# EAGLE design 20190105_ORIGAMI_V1-H-08slot-fixed (EAGLE 9.2.2)
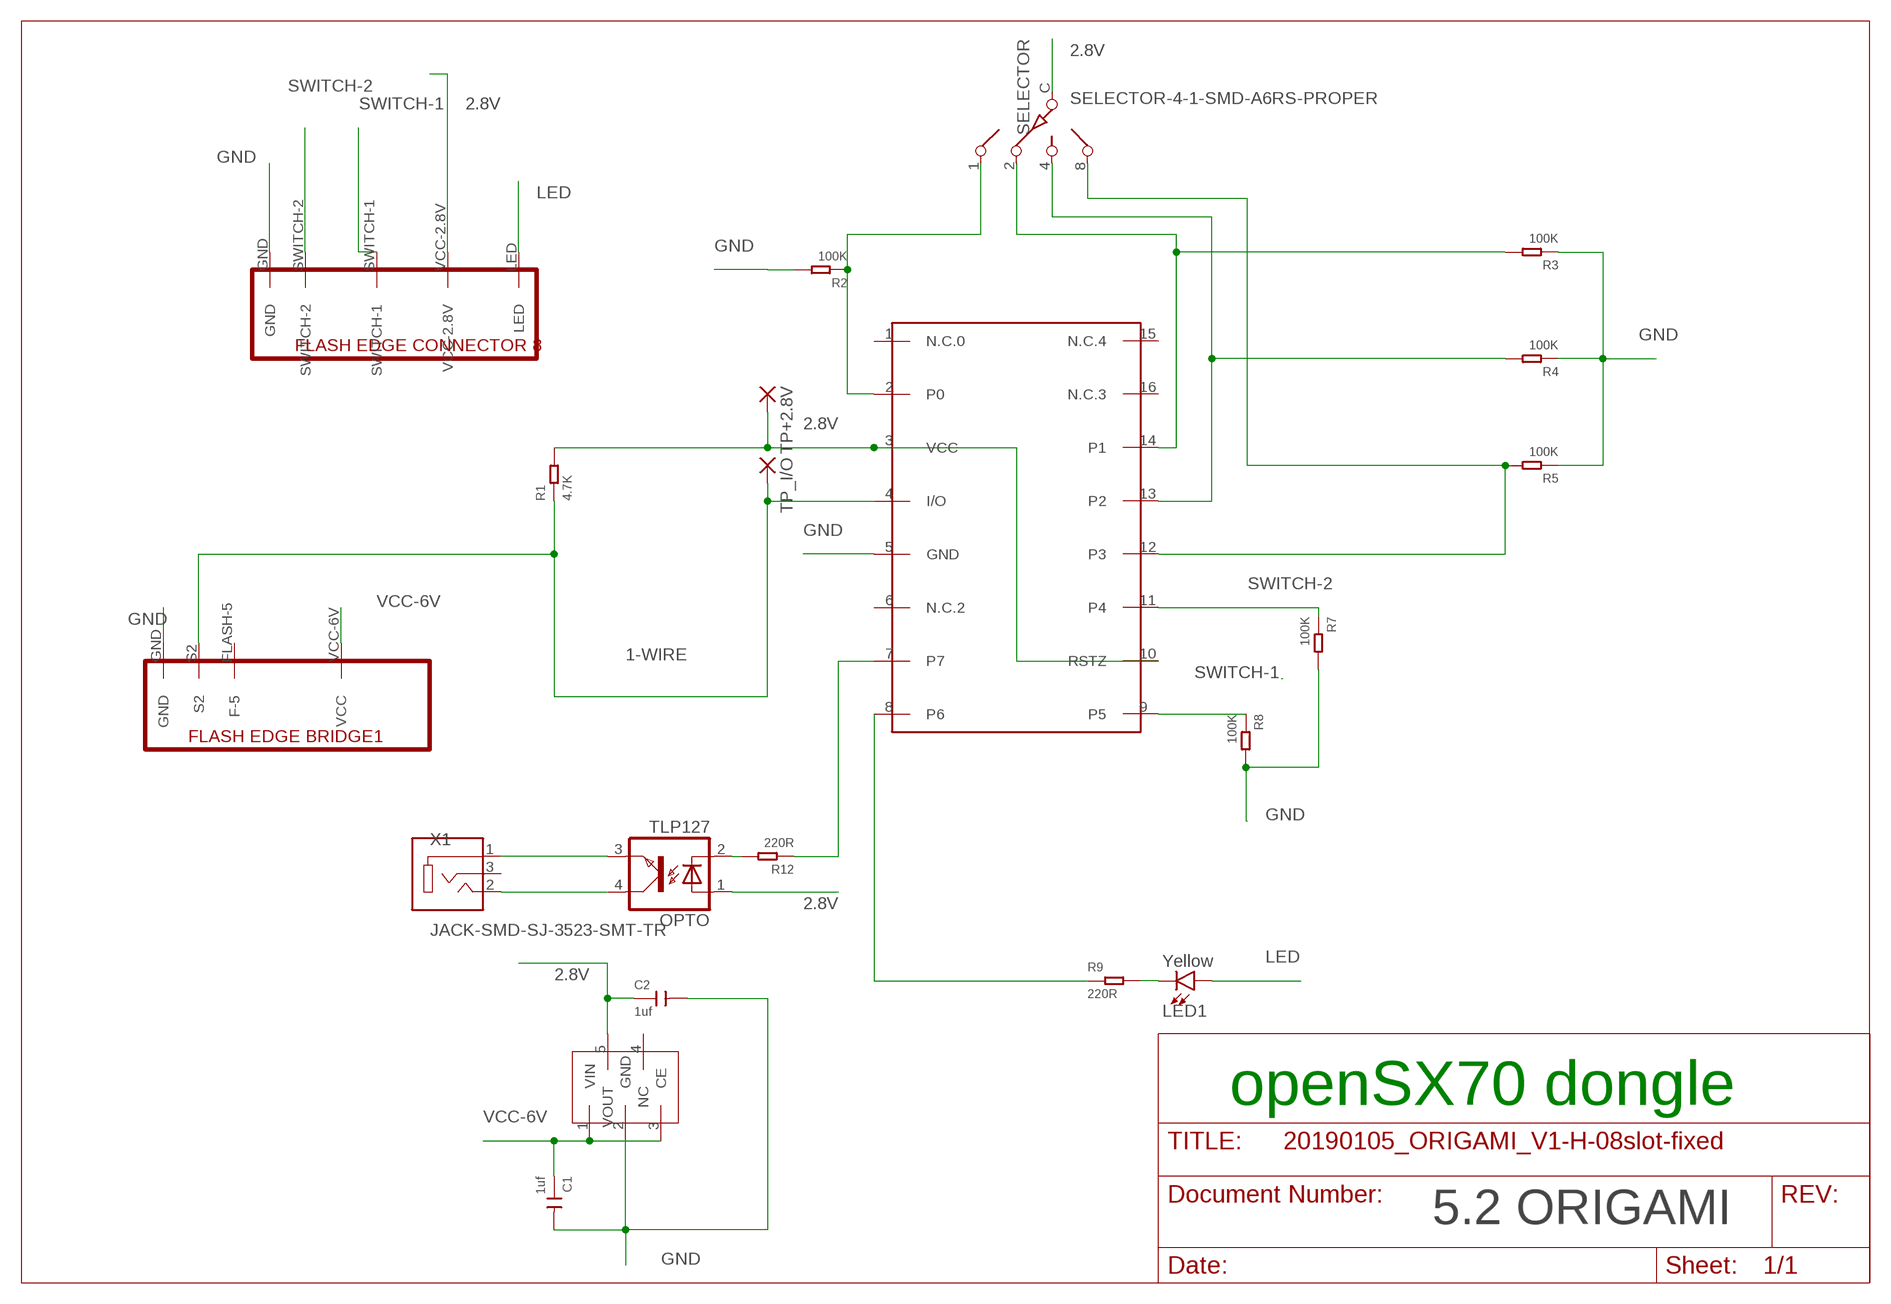
[diagram p0: schematic, sheet 1]

## Parts
C1  1uf  CERAMIC-1UF-25V-10%-X7R(0603)  [C0603]
C2  1uf  CERAMIC-1UF-25V-10%-X7R(0603)  [C0603]
DS2408  DS2408  [SO16]
LED1  Yellow  LED-YELLOWLILYPAD  [LED-1206]
OPTO  TLP127  [SO-4]
R1  4.7K  SMD-RES-4.7K-5%-1/10W(0603)  [R0603]
R2  100K  SMD-RES-100K-1%-1/10W(0603)  [R0603]
R3  100K  SMD-RES-100K-1%-1/10W(0603)  [R0603]
R4  100K  SMD-RES-100K-1%-1/10W(0603)  [R0603]
R5  100K  SMD-RES-100K-1%-1/10W(0603)  [R0603]
R7  100K  SMD-RES-100K-1%-1/10W(0603)  [R0603]
R8  100K  SMD-RES-100K-1%-1/10W(0603)  [R0603]
R9  220R  SMD-RES-220R-5%-1/10W(0603)  [R0603]
R12  220R  SMD-RES-220R-5%-1/10W(0603)  [R0603]
REG  NCP4688  [SOT-23-5]
SELECTOR  SELECTOR-4-1-SMD-A6RS-PROPER  [A6RS-161RS]
TP+2.8V  SMD2  [SMD1,27-2,54]
TP_I/O  SMD2  [SMD1,27-2,54]
U$1  FLASH-BRIDGE-SW1-SW2-LED  [FLASH-8-BRIDGE-SW1-SW2-LED]
U$2  FLASH-BRIDGE1  [FLASH-8-BRIDGE1]
X1  JACK-SMD-SJ-3523-SMT-TR  [CUI_SJ-3523-SMT-TR]

## Nets
1-WIRE: DS2408.4(I/O) R1.1 TP_I/O.1(P) U$2.S2
2.8V: C2.1 DS2408.3(VCC) DS2408.10(RSTZ) OPTO.1(A) R1.2 REG.5(VOUT) SELECTOR.C TP+2.8V.1(P) U$1.VCC-2.8V
GND: C1.2 C2.2 DS2408.5(GND) R2.2 R3.1 R4.1 R5.1 R7.2 R8.2 REG.2(GND) U$1.GND U$2.GND
LED: LED1.A U$1.LED
N$1: OPTO.3(EMIT) X1.1
N$2: LED1.C R9.2
N$3: DS2408.2(P0) R2.1 SELECTOR.1
N$4: DS2408.14(P1) R3.2 SELECTOR.2
N$5: DS2408.13(P2) R4.2 SELECTOR.4
N$6: OPTO.4(COL) X1.2
N$7: DS2408.8(P6) R9.1
N$10: OPTO.2(C) R12.2
N$11: DS2408.7 R12.1
N$13: DS2408.12(P3) R5.2 SELECTOR.8
SWITCH-1: DS2408.9(P5) R8.1 U$1.SWITCH-1
SWITCH-2: DS2408.11(P4) R7.1 U$1.SWITCH-2
VCC-6V: C1.1 REG.1(VIN) REG.3(CE) U$2.VCC-6V(VCC)
Unconnected: DS2408.1(N.C.0) DS2408.6(N.C.2) DS2408.15(N.C.4) DS2408.16(N.C.3) REG.4(NC) U$2.FLASH-5(F-5) X1.3

## Notes on the sheet
- openSX70 dongle
- 5.2 ORIGAMI

## Library data of the parts
C1 C2 = Seeed-Capacitor:CERAMIC-1UF-25V-10%-X7R(0603): 302010139; MPN: CC0603KRX7R8BB105
DS2408 = _openSX70:DS2408
LED1 = SparkFun-LED:LED-YELLOW: Yellow SMD LED Used in manufacturing several products at SparkFun. Packages: 0603 - SMD 0603 package[Product Link] <http://www.kingbrightusa.com/product.asp?catalog_name=LED&product_id=APT1608SYCK> 0603 -SMART - SMART SMD 0603 package (more efficient/more expensive) [Product Link] <http://www.osram-os.com/osram_os/en/products/product-catalog/led-light-emitting-diodes/smartled-0603/ly-l29k/index.jsp> LilyPad - SMD1206 package[Product Datasheet] <https://www.sparkfun.com/datasheets/DevTools/LilyPad/Q150YUS4.pdf> SparkFun Products: Blynk Board <https://www.sparkfun.com/products/13794> IOIO-OTG <https://www.sparkfun.com/products/13613> XBee Explorer Serial <https://www.sparkfun.com/products/13225>; PROD_ID: DIO-09909
OPTO = _openSX70:TLP127
R1 = Seeed-Resistor:SMD-RES-4.7K-5%-1/10W(0603): 301010290; MPN: RC0603JR-074K7L
R2-R5 R7 R8 = Seeed-Resistor:SMD-RES-100K-1%-1/10W(0603): 301010196; MPN: RC0603FR-07100KL
R9 R12 = Seeed-Resistor:SMD-RES-220R-5%-1/10W(0603): 301010163; MPN: RC0603JR-07220RL
REG = openSX70:NCP4688
SELECTOR = _openSX70:SELECTOR-4-1-SMD-A6RS-PROPER
TP+2.8V TP_I/O = wirepad:SMD2: SMD PAD
U$1 = _openSX70:FLASH-BRIDGE-SW1-SW2-LED
U$2 = _openSX70:FLASH-BRIDGE1
X1 = _openSX70:JACK-SMD-SJ-3523-SMT-TR: Audio Jack Connector 3.5 mm Low Profile Surface Mount Stereo Jack, 3 Pin Right-Angle; AVAILABILITY: Unavailable; CUI_PURCHASE_URL: https://www.cui.com/product/interconnect/audio-connectors/3.5-mm-jacks/sj-352x-smt-series?utm_source=snapeda.com&utm_medium=referral&utm_campaign=snapedaBOM; DESCRIPTION: SJ Series 3.5 mm 12 V SMT Right Angle Stereo Audio Jack; MF: CUI Inc.; MP: SJ-3523-SMT-TR; PACKAGE: LGA-10 STMicroelectronics; PRICE: None

## Net classes
0 GND: width 0.305 mm
1 VCC: width 0.254 mm
2 2.8V: width 0.254 mm

## Board
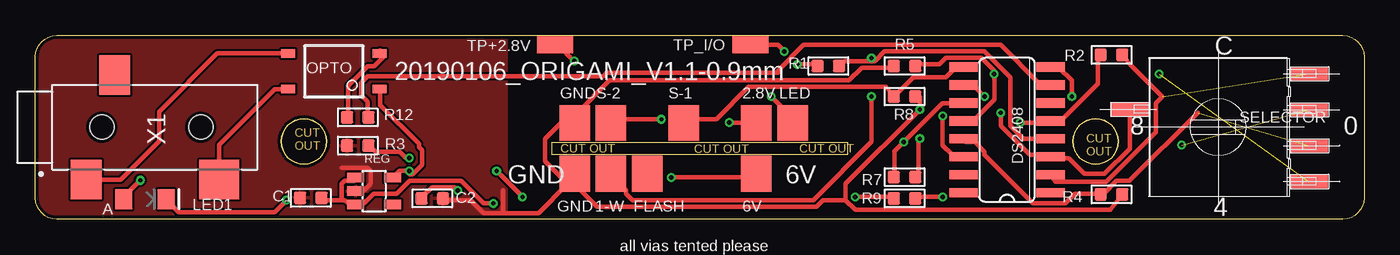
[diagram p1: board, top side]
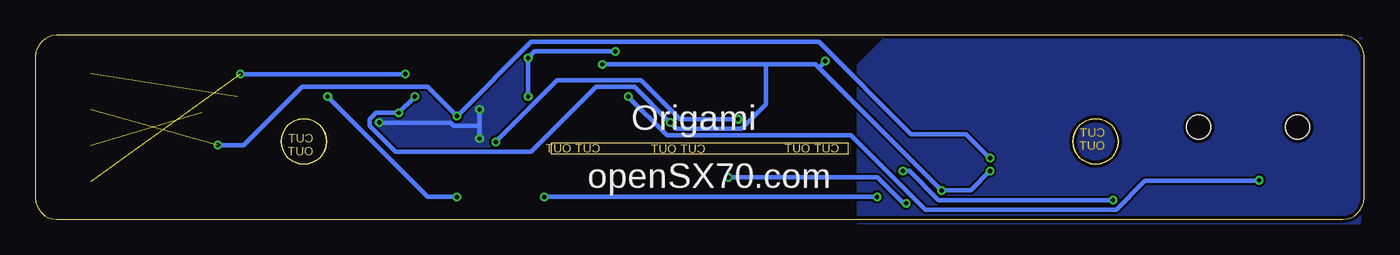
[diagram p2: board, bottom side, seen from below]

Size 94 x 13 mm. Coordinates in mm from the lower left corner, seen from the top.
Outline: 75,7.11 75.32,7.07 75.62,6.98 75.9,6.83 76.14,6.64
Outline: 76.14,6.64 76.33,6.4 76.48,6.13 76.57,5.82 76.61,5.5
Outline: 76.61,5.5 76.57,5.18 76.48,4.88 76.33,4.6 76.14,4.37
Outline: 76.14,4.37 75.9,4.17 75.62,4.02 75.32,3.93 75,3.9
Outline: 75,3.9 74.68,3.93 74.38,4.02 74.1,4.17 73.87,4.37
Outline: 73.87,4.37 73.67,4.6 73.52,4.88 73.43,5.18 73.4,5.5
Outline: 73.4,5.5 73.43,5.82 73.52,6.13 73.67,6.4 73.87,6.64
Outline: 73.87,6.64 74.1,6.83 74.38,6.98 74.68,7.07 75,7.11
Outline: 19,7.11 19.32,7.07 19.62,6.98 19.9,6.83 20.14,6.64
Outline: 20.14,6.64 20.33,6.4 20.48,6.13 20.57,5.82 20.61,5.5
Outline: 20.61,5.5 20.57,5.18 20.48,4.88 20.33,4.6 20.14,4.37
Outline: 20.14,4.37 19.9,4.17 19.62,4.02 19.32,3.93 19,3.9
Outline: 19,3.9 18.68,3.93 18.38,4.02 18.1,4.17 17.87,4.37
Outline: 17.87,4.37 17.67,4.6 17.52,4.88 17.43,5.18 17.4,5.5
Outline: 17.4,5.5 17.43,5.82 17.52,6.13 17.67,6.4 17.87,6.64
Outline: 17.87,6.64 18.1,6.83 18.38,6.98 18.68,7.07 19,7.11
Outline: 75,7.11 74.69,7.07 74.39,6.98 74.11,6.83 73.87,6.64
Outline: 73.87,6.64 73.67,6.39 73.52,6.11 73.43,5.81 73.4,5.5
Outline: 73.4,5.5 73.43,5.19 73.52,4.89 73.67,4.61 73.87,4.37
Outline: 73.87,4.37 74.11,4.17 74.39,4.02 74.69,3.93 75,3.9
Outline: 75,3.9 75.31,3.93 75.61,4.02 75.89,4.17 76.14,4.37
Outline: 76.14,4.37 76.33,4.61 76.48,4.89 76.57,5.19 76.61,5.5
Outline: 76.61,5.5 76.57,5.81 76.48,6.11 76.33,6.39 76.14,6.64
Outline: 76.14,6.64 75.89,6.83 75.61,6.98 75.31,7.07 75,7.11
Outline: 19,7.11 18.69,7.07 18.39,6.98 18.11,6.83 17.87,6.64
Outline: 17.87,6.64 17.67,6.39 17.52,6.11 17.43,5.81 17.4,5.5
Outline: 17.4,5.5 17.43,5.19 17.52,4.89 17.67,4.61 17.87,4.37
Outline: 17.87,4.37 18.11,4.17 18.39,4.02 18.69,3.93 19,3.9
Outline: 19,3.9 19.31,3.93 19.61,4.02 19.89,4.17 20.14,4.37
Outline: 20.14,4.37 20.33,4.61 20.48,4.89 20.57,5.19 20.61,5.5
Outline: 20.61,5.5 20.57,5.81 20.48,6.11 20.33,6.39 20.14,6.64
Outline: 20.14,6.64 19.89,6.83 19.61,6.98 19.31,7.07 19,7.11
Outline: 1.51,13 92.49,13 92.8,12.97 93.08,12.88 93.33,12.74 93.56,12.56 93.74,12.33 93.88,12.08 93.97,11.8 94,11.49 94,1.51 93.97,1.2 93.88,0.92 93.74,0.67 93.56,0.44 93.33,0.26 93.08,0.12 92.8,0.03 92.49,0 1.51,0 1.2,0.03 0.92,0.12 0.67,0.26 0.44,0.44 0.26,0.67 0.12,0.92 0.03,1.2 0,1.51 0,11.49 0.03,11.8 0.12,12.08 0.26,12.33 0.44,12.56 0.67,12.74 0.92,12.88 1.2,12.97 1.51,13
Outline: 36.5,4.61 57.5,4.61 57.5,5.41 36.5,5.41 36.5,4.61
Copper layers (1*16): Top 0.035mm / dielectric 1.5mm / Bottom 0.035mm
Design rules "SeeedStudio_2layer_DRU_no_angle_20140221": minimum track width 6mil, minimum drill 12mil, track to track 6mil, track to pad 6mil, pad to pad 6mil, via to via 6mil, smd to smd 0mil, copper to edge 10mil, drill to drill 10mil, minimum pad ring 10mil, minimum via ring 6mil, stop-mask expansion 2mil, vias tented up to drill 100mil, thermal gap 10mil

### Footprints (pad centres in the part's own frame; a part is rotated, then mirrored left to right if it is on the bottom)
C0603 = smd 0.889 x 0.889: 1 0,0.762; 2 0,-0.762
SO16 = smd 0.66 x 2.032: 1 -4.445,-3.073; 2 -3.175,-3.073; 3 -1.905,-3.073; 4 -0.635,-3.073; 5 0.635,-3.073; 6 1.905,-3.073; 7 3.175,-3.073; 8 4.445,-3.073; 9 4.445,3.073; 10 3.175,3.073; 11 1.905,3.073; 12 0.635,3.073; 13 -0.635,3.073; 14 -1.905,3.073; 15 -3.175,3.073; 16 -4.445,3.073
LED-1206 = smd 1.2 x 1.4: A -1.5,0; C 1.5,0
SO-4 = smd 1 x 0.6: 1 -3.24,0.635; 2 -3.24,-1.905; 3 3.24,-1.905; 4 3.24,0.635
R0603 = smd 0.889 x 0.889: 1 0,0.762; 2 0,-0.762
SOT-23-5 = smd 0.69 x 1.2: 1 -0.95,-1.3; 2 0,-1.3; 3 0.95,-1.3; 4 0.95,1.3; 5 -0.95,1.3
A6RS-161RS = smd 1 x 2.7: 1 8.89,-1.397; 2 6.35,-1.397; 4 3.81,-1.397; 8 1.27,-1.397; C 6.35,11.303
SMD1,27-2,54 = smd 1.27 x 2.54: 1 0,0
FLASH-8-BRIDGE-SW1-SW2-LED = smd 2.159 x 2.54: GND -9,7.5; LED 6.42,7.5; SWITCH-1 -1.29,7.5; SWITCH-2 -6.43,7.5; VCC-2.8V 3.85,7.5
FLASH-8-BRIDGE1 = smd 2.159 x 2.54: FLASH-5 -3.86,7.5; GND -9,7.5; S2 -6.43,7.5; VCC-6V 3.85,7.5
CUI_SJ-3523-SMT-TR = smd 2.2 x 2.8: 1 -1.1,-3.7; 3 0.9,3.7 | smd 2.8 x 2.8: 2 8.3,-3.7 | hole 1.7: 0,0; 7,0

### Placement (x,y rotation side)
C1  19.48,1.51 270 top
C2  28.08,1.47 90 top
DS2408  68.74,6.32 90 top
LED1  7.75,1.41 0 top
OPTO  21.12,9.83 180 top
R1  56.09,10.84 270 top
R2  76.12,11.63 270 top
R3  22.8,5.21 90 top
R4  76.12,1.75 270 top
R5  61.49,10.84 90 top
R7  61.49,2.99 90 top
R8  61.49,8.68 90 top
R9  61.49,1.47 270 top
R12  22.8,7.2 270 top
REG  23.97,2 270 top
SELECTOR  88.69,1.39 90 top
TP+2.8V  36.76,12.37 90 top
TP_I/O  50.6,12.37 90 top
U$1  47.14,-0.69 0 top
U$2  47.14,-4.29 0 top
X1  4.7,6.51 0 top

### Tracks (layer width: path | path; a pad name or v marks a point on that pad's centre or on a via)
1-WIRE  (via drill 0.3)
  Top 0.305: 59.15,11.18 59.38,11.18 60.06,11.87 67.15,11.87 68.98,10.04 68.98,6.61 69.89,5.7 71.72,5.7 DS2408.4 | 59.15,11.18 57.22,11.18 R1.1 | v59.15,8.67 59.15,5.47 55.03,1.35 42.23,1.35 41.78,1.81 41.78,2.04 40.86,2.95 U$2.S2 | v59.15,11.41 59.15,11.18 | v52.98,11.87 52.52,12.33 50.69,12.33 TP_I/O.1
  Bottom 0.305: v59.15,8.67 v59.15,11.41 58.69,11.87 v52.98,11.87
2.8V  (via drill 0.3)
  Top 0.305: SELECTOR.C 77.41,7.73 77.41,4.98 75.64,3.21 74.21,3.21 73.09,4.33 71.95,4.33 DS2408.3 71.72,4.55 70.35,4.55 68.29,6.61 v68.29,7.53 | v67.15,8.67 66.46,9.36 65.78,9.36 DS2408.10 | v29.89,2.04 29.66,2.27 28.06,2.27 27.37,1.58 C2.1 | 26.23,3.41 25.77,3.41 25.32,2.95 REG.5 | v53.89,10.96 55.04,10.96 R1.2 | v38.12,11.18 36.97,12.33 TP+2.8V.1 | v49.09,6.84 50.92,6.84 U$1.VCC-2.8V | 26.23,3.41 26.46,3.18 26.69,3.18 27.37,3.87 27.37,4.78 27.38,4.87 27.15,5.09 27.15,5.32 24.4,8.07 24.4,8.98 OPTO.1 | v26.46,3.41 26.23,3.41
  Bottom 0.305: v67.15,8.67 v68.29,7.53 69.89,7.53 70.35,7.07 70.35,6.61 68.52,4.78 58.92,4.78 54.35,9.36 51.61,9.36 v49.09,6.84 48.63,6.38 44.06,6.38 42.3,8.14 42.3,10.96 | v26.46,3.41 27.83,2.04 v29.89,2.04 38.58,10.73 | 42.3,10.96 38.8,10.96 38.58,10.73 | v53.89,10.96 42.3,10.96 | 38.58,10.73 v38.12,11.18
GND  (via drill 0.3)
  Top 0.305: 72.64,7.07 71.95,7.07 DS2408.5 | v62.58,5.7 62.48,5.6 62.48,3.25 R7.2 | R8.2 62.58,8.65 v62.58,7.76 57.32,2.5 57.32,1.35 | 57.32,1.35 58.01,0.67 76.03,0.67 R4.1 | v69.66,6.84 71.72,6.84 DS2408.5 | R5.1 60.56,10.73 58.46,10.73 57.55,9.81 40.63,9.81 38.35,7.53 38.35,7.07 U$1.GND 38.12,6.84 37.2,6.84 36.06,5.7 36.06,4.1 37.66,2.5 | 21.66,3.64 23.49,3.64 23.72,3.41 23.72,2.5 23.26,2.04 22.8,2.04 REG.2 | 18.92,1.58 C1.2 | 33.09,0.44 35.6,0.44 37.66,2.5 | 33.09,0.44 31.72,0.44 30.8,1.35 28.97,1.35 C2.2 | 37.89,2.73 38.12,2.95 U$2.GND | 37.89,2.73 37.66,2.5 | 33.09,2.04 33.09,0.44 | U$2.GND 37.66,2.5 | 57.32,1.35 55.72,1.35 55.26,0.9 39.72,0.9 37.89,2.73 | U$2.GND 37.89,2.73 | 72.64,7.07 75.15,9.58 75.15,11.28 R2.2 | 72.64,7.07 DS2408.5
  Bottom 0.305: v62.58,7.76 62.58,6.61 | 62.58,6.61 v62.58,5.7 | v69.66,6.84 64.64,6.84 64.41,6.61 62.58,6.61
  pour Bottom: 0.14,12.81 33.94,12.81 35.84,10.91 35.84,-0.29 0.34,-0.29 0.24,-0.19 0.24,12.71
  pour Bottom: 58.94,12.91 58.94,0.01 94.24,0.01 94.34,0.11 94.34,13.21 59.24,13.21
  pour Top: 0.24,12.81 33.34,12.81 33.34,-0.29 0.14,-0.29 0.14,12.81 0.04,12.91
LED  (via drill 0.3)
  Top 0.305: v52.06,8.67 53.66,7.07 U$1.LED | 6.3,1.35 LED1.A 6.25,1.57 v7.43,2.75
  Bottom 0.305: v52.06,8.67 49.32,5.93 36.29,5.93 31.03,0.67 17.54,0.67 15.51,2.71 7.48,2.71 v7.43,2.75
N$1
  Top 0.305: 17.78,11.72 OPTO.3 12.87,11.73 8.74,7.61 8.74,5.51 6.04,2.81 X1.1
N$2  (via drill 0.3)
  Top 0.305: v58.01,1.58 60.61,1.58 R9.2 | v34.46,1.58 v32.63,3.41 | 9.27,1.35 LED1.C 10.15,0.51 16.93,0.51 v17.77,1.35
  Bottom 0.305: v58.01,1.58 v34.46,1.58 | v32.63,3.41 32.17,3.41 30.12,1.35 v17.77,1.35
N$3  (1 unrouted)
  Top 0.305: DS2408.2 72.16,2.65 75.77,2.65 79.27,6.16 79.27,8.21 79.72,8.67 77.47,10.92 R2.1
N$4  (via drill 0.3)  (1 unrouted)
  Top 0.305: v64.18,7.3 64.18,5.24 64.86,4.55 65.55,4.55 DS2408.14 | v26.46,4.33 26.23,4.33 25.77,4.78 24.09,4.78 23.64,5.24 23.72,5.32 R3.2
  Bottom 0.305: v26.46,4.33 28.16,6.03 32.05,6.03 38.58,12.56 58.92,12.56 v64.18,7.3 66.24,9.36 75.14,9.36 79.25,5.24 v81.09,5.24
N$5  (1 unrouted)
  Top 0.305: 75.28,1.81 73.55,1.81 72.87,1.13 70.58,1.13 67.15,4.55 67.15,4.78 66.46,5.47 65.78,5.47 DS2408.13 | R4.2 75.28,1.81 | 82.22,7.53 77.4,2.71 76.46,2.71 75.57,1.81 75.28,1.81
N$6
  Top 0.305: OPTO.4 16.93,9.19 13,5.27 X1.2
N$7  (via drill 0.3)
  Top 0.305: v64.18,1.58 62.44,1.58 R9.1 | v73.32,8.67 73.32,9.81 72.41,10.73 71.95,10.73 DS2408.8
  Bottom 0.305: v64.18,1.58 66.24,1.58 v73.32,8.67
N$10
  Top 0.305: R12.2 22.12,7.38 22.12,9.44 23.49,10.81 23.95,10.81 24.63,11.49 24.63,11.72 24.4,11.95 OPTO.2
N$11
  Top 0.305: DS2408.7 71.72,9.58 71.04,9.58 68.29,12.33 54.35,12.33 52.52,10.5 52.52,10.35 40.41,10.35 40.18,10.12 23.49,10.12 23.03,9.67 23.03,8.75 23.49,8.29 23.49,7.38 R12.1
N$13  (via drill 0.3)  (1 unrouted)
  Top 0.305: R5.2 62.36,10.96 63.95,10.96 64.41,11.41 66.92,11.41 67.84,10.5 v67.84,10.27 67.84,8.44 66.46,7.07 65.78,7.07 DS2408.12
  Bottom 0.305: v79.49,10.27 v67.84,10.27
SWITCH-1
  Top 0.305: DS2408.9 65.55,10.73 65.09,10.73 64.41,10.04 62.12,10.04 60.77,8.69 R8.1 60.16,9.36 50.46,9.36 48.18,7.07 45.89,7.07 U$1.SWITCH-1
SWITCH-2  (via drill 0.3)
  Top 0.305: R7.1 60.78,3.1 60.78,4.81 v61.44,5.47 64.18,8.21 65.55,8.21 DS2408.11 | v44.29,7.07 40.86,7.07 U$1.SWITCH-2
  Bottom 0.305: v44.29,7.07 48.4,7.07 51.15,9.81 57.09,9.81 v61.44,5.47
VCC-6V  (via drill 0.3)
  Top 0.305: 21.66,1.35 21.89,1.35 22.12,1.13 22.57,1.13 REG.3 22.8,1.13 23.26,1.13 23.94,1.81 25.54,1.81 26.46,2.73 30.12,2.73 31.72,1.13 v32.4,1.13 | 21.66,1.35 20.29,1.35 C1.1 | 21.66,1.35 21.66,2.5 21.89,2.73 22.57,2.73 REG.1 | v44.98,2.95 50.92,2.95 U$2.VCC-6V
  Bottom 0.305: v44.98,2.95 34.43,2.95 32.6,1.13 v32.4,1.13

### Text on the board
Dimension: CUT / OUT | CUT OUT | CUT OUT | CUT OUT | CUT / OUT
tPlace: 20190106_ORIGAMI_V1.1-0.9mm
tNames: C | GND | S-2 | S-1 | 2.8V | LED | 8 | 0 | GND | 6V | A | GND | 1-W | FLASH | 6V | 4 | all vias tented please
bNames: Origami | openSX70.com